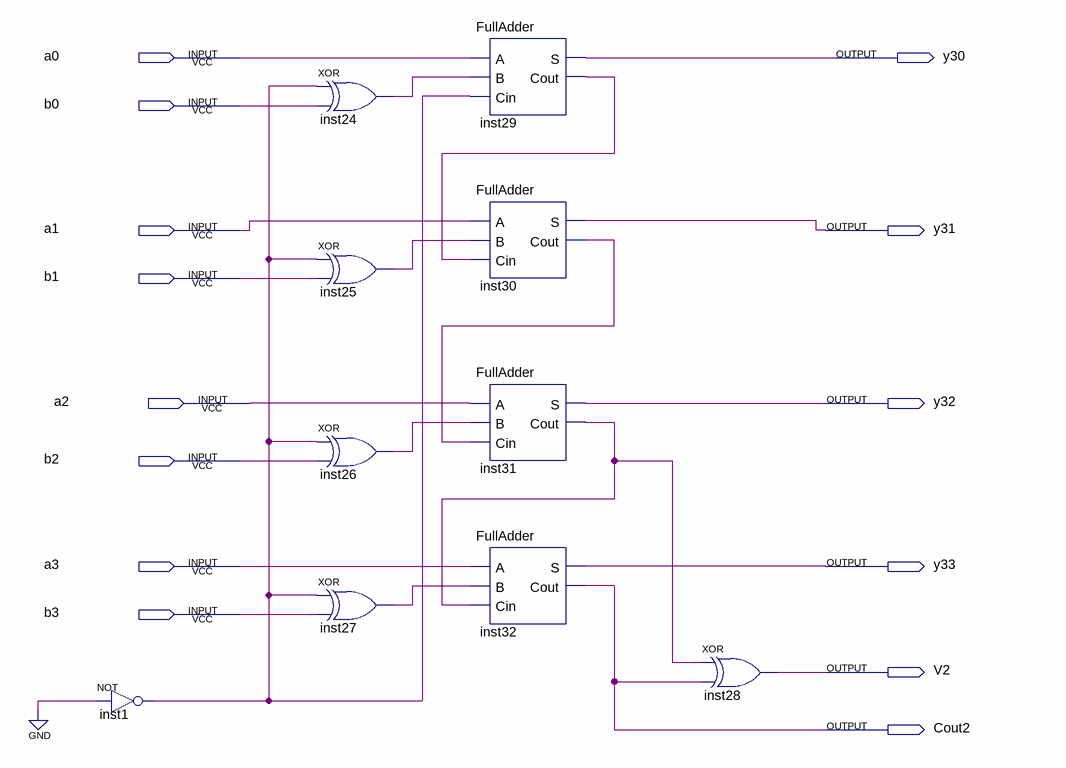
[diagram p0: schematic sheet]
// Quartus schematic minus.bdf as structural Verilog: 10 symbols, 14 pins
module minus (
  input  a0,
  input  b0,
  input  a1,
  input  b1,
  input  a2,
  input  b2,
  input  a3,
  input  b3,
  output y30,
  output y31,
  output y32,
  output y33,
  output V2,
  output Cout2
);

  wire inst1_out, inst24_out, inst25_out, inst26_out, inst27_out, inst29_cout, inst30_cout, inst31_cout;

  not inst1 (inst1_out, 1'b0);
  xor inst24 (inst24_out, inst1_out, b0);
  xor inst25 (inst25_out, inst1_out, b1);
  xor inst26 (inst26_out, inst1_out, b2);
  xor inst27 (inst27_out, inst1_out, b3);
  FullAdder inst29 (.A(a0), .B(inst24_out), .Cin(inst1_out), .S(y30), .Cout(inst29_cout));
  FullAdder inst30 (.A(a1), .B(inst25_out), .Cin(inst29_cout), .S(y31), .Cout(inst30_cout));
  FullAdder inst31 (.A(a2), .B(inst26_out), .Cin(inst30_cout), .S(y32), .Cout(inst31_cout));
  FullAdder inst32 (.A(a3), .B(inst27_out), .Cin(inst31_cout), .S(y33), .Cout(Cout2));
  xor inst28 (V2, inst31_cout, Cout2);
endmodule
